# EAGLE design GPS_Tracker_V3 (EAGLE 6.5.0)
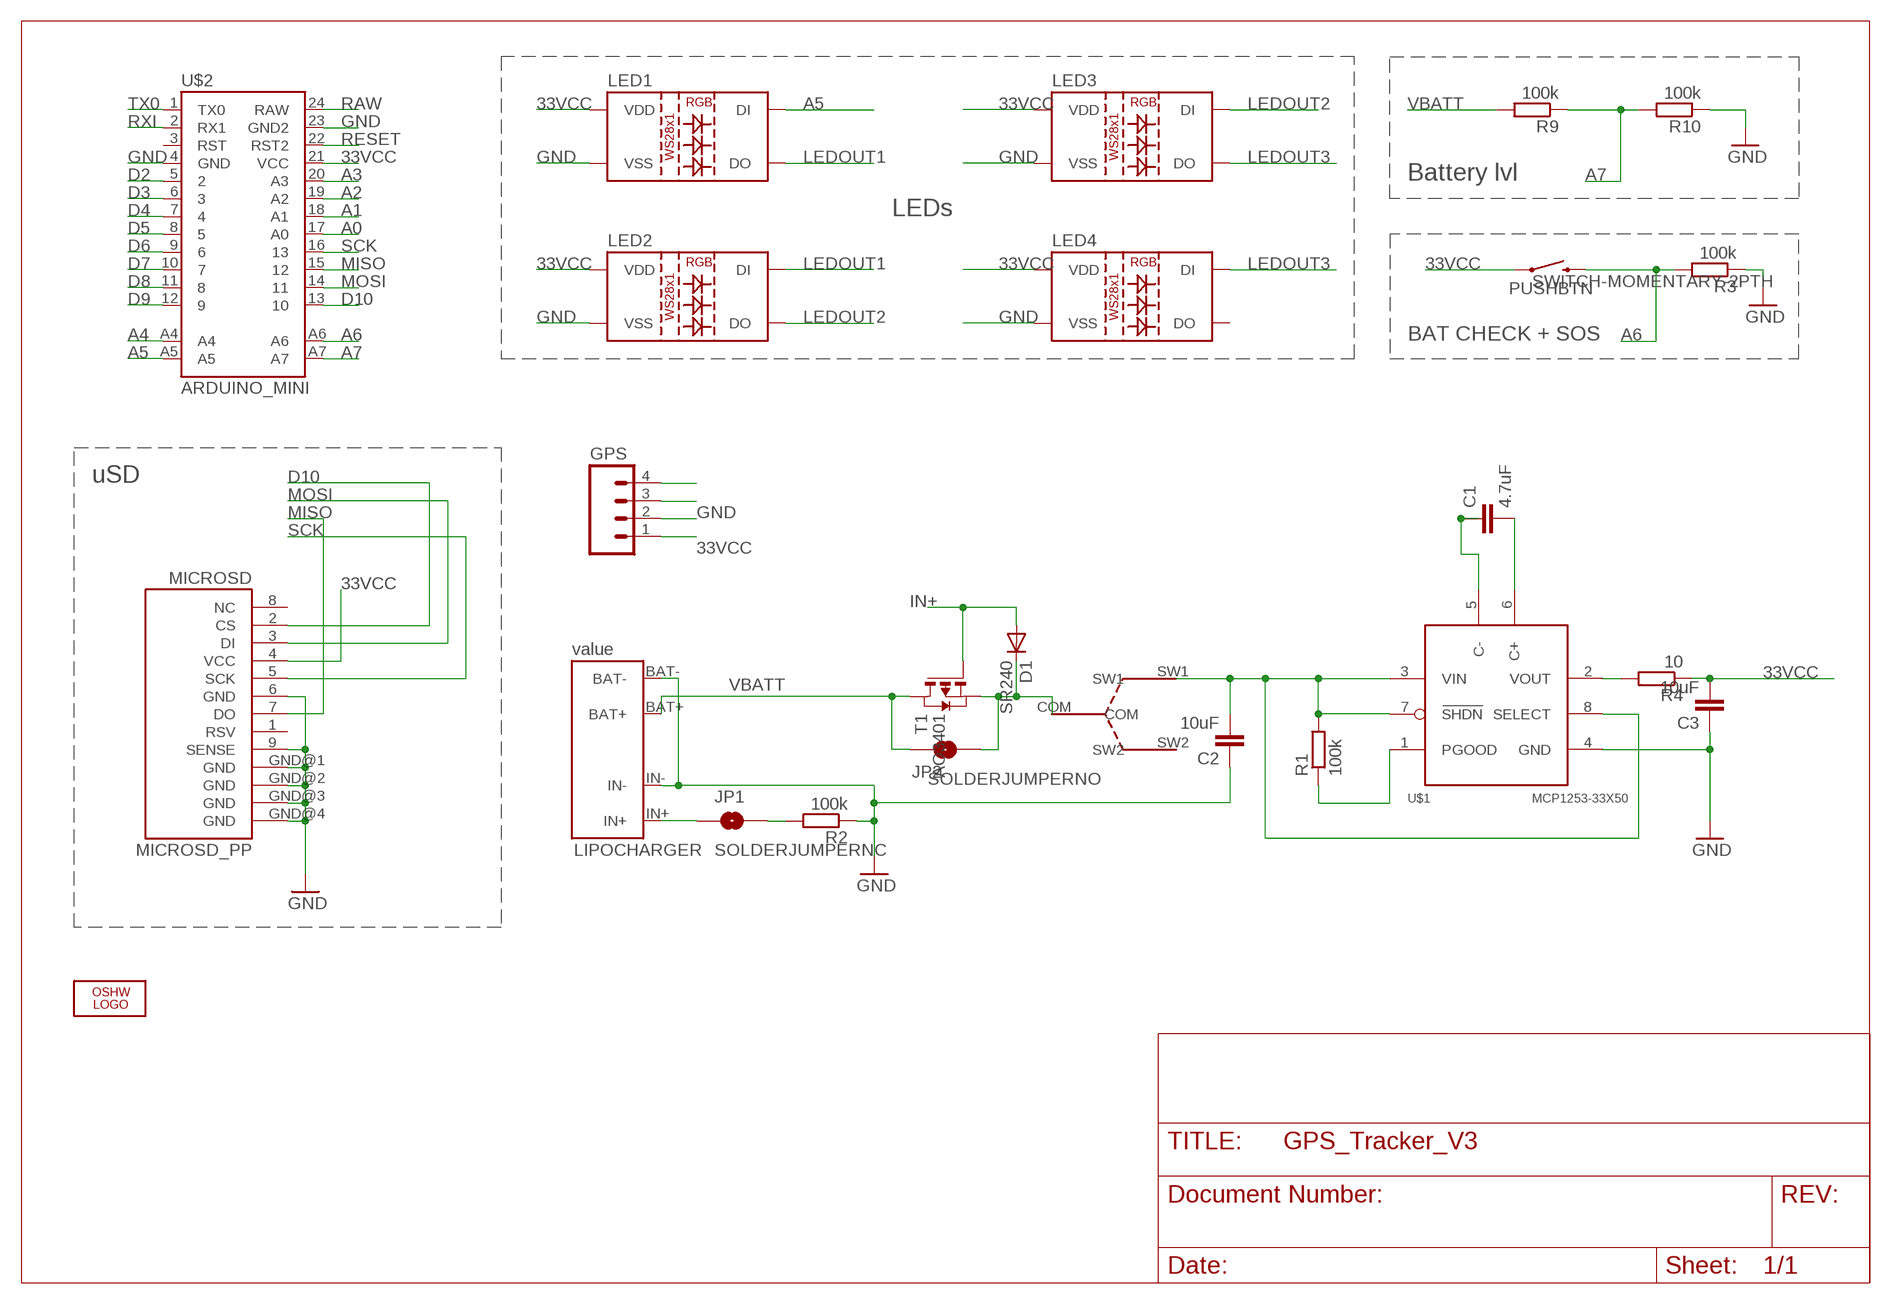
[diagram p0: schematic, sheet 1]

## Parts
C1  4.7uF  C-EUC1206  [C1206]
C2  10uF  C-EUC1206  [C1206]
C3  10uF  C-EUC1206  [C1206]
D1  SR240  DIODE-DO214AC  [DO214AC]
GPS  M04PTH  [1X04]
JP1  SOLDERJUMPERNC  [SJ_2S]
JP2  SOLDERJUMPERNO  [SJ_2S-NO]
LED1  LED-TRICOLOR-5050-ICWS2811  [LED-TRICOLOR-5050-IC]
LED2  LED-TRICOLOR-5050-ICWS2811  [LED-TRICOLOR-5050-IC]
LED3  LED-TRICOLOR-5050-ICWS2811  [LED-TRICOLOR-5050-IC]
LED4  LED-TRICOLOR-5050-ICWS2811  [LED-TRICOLOR-5050-IC]
LIPOCHARGER  LIPO_CHARGER  [LIPO_CHARGER]
LOGO1  OSHW_LOGO_10MILX0200-NT  [OSHW_10X200_NOTEXT]
MICROSD  MICROSD_PP  [MICROSD_PP]
PUSHBTN  SWITCH-MOMENTARY-2PTH  [TACTILE-PTH]
R1  100k  R-EU_R1206  [R1206]
R2  100k  R-EU_R1206  [R1206]
R3  100k  R-EU_R1206  [R1206]
R4  10  R-EU_R1206  [R1206]
R9  100k  R-EU_R1206  [R1206]
R10  100k  R-EU_R1206  [R1206]
SW  SWITCHDAV  [5IL3MM]
T1  AO3401  PMOSSOT23  [SOT-23]
U$1  MCP1253-33X50  [MSOP8]
U$2  ARDUINO_MINI  [ARDUINO_MINI]

## Nets
33VCC: C3.2 GPS.1 LED1.3(VDD) LED1.5(VDD) LED2.3(VDD) LED2.5(VDD) LED3.3(VDD) LED3.5(VDD) LED4.3(VDD) LED4.5(VDD) MICROSD.4(VCC) PUSHBTN.1 R4.1 U$2.21(VCC)
A0: U$2.17(A0)
A1: U$2.18(A1)
A2: U$2.19(A2)
A3: U$2.20(A3)
A4: U$2.A4
A5: LED1.2(DI) U$2.A5
A6: PUSHBTN.3 R3.2 U$2.A6
A7: R9.1 R10.2 U$2.A7
D2: U$2.5
D3: U$2.6
D4: U$2.7
D5: U$2.8
D6: U$2.9
D7: U$2.10
D8: U$2.11
D9: U$2.12
D10: MICROSD.2(CS) U$2.13
GND: C2.1 C3.1 GPS.2 LED1.6(VSS) LED2.6(VSS) LED3.6(VSS) LED4.6(VSS) LIPOCHARGER.BAT- LIPOCHARGER.IN- MICROSD.6(GND) MICROSD.9(SENSE) MICROSD.GND@1(GND) MICROSD.GND@2(GND) MICROSD.GND@3(GND) MICROSD.GND@4(GND) R2.1 R3.1 R10.1 U$1.4(GND) U$2.4(GND) U$2.23(GND2)
IN+: D1.A JP1.2 R2.2 T1.3(G)
LEDOUT1: LED1.1(DO) LED2.2(DI)
LEDOUT2: LED2.1(DO) LED3.2(DI)
LEDOUT3: LED3.1(DO) LED4.2(DI)
MISO: MICROSD.7(DO) U$2.15
MOSI: MICROSD.3(DI) U$2.14
N$1: C2.2 R1.2 SW.SW1 U$1.3(VIN) U$1.7(SHDN) U$1.8(SELECT)
N$2: C1.1 U$1.5(C-)
N$3: C1.2 U$1.6(C+)
N$4: D1.C JP2.2 SW.COM T1.2(S)
N$5: R1.1 U$1.1(PGOOD)
N$6: R4.2 U$1.2(VOUT)
N$7: JP1.1 LIPOCHARGER.IN+
N$8: GPS.3
N$9: GPS.4
RAW: U$2.24(RAW)
RESET: U$2.22(RST2)
RXI: U$2.2(RX1)
SCK: MICROSD.5(SCK) U$2.16
TX0: U$2.1(TX0)
VBATT: JP2.1 LIPOCHARGER.BAT+ R9.2 T1.1(D)
Unconnected: LED4.1(DO) MICROSD.1(RSV) MICROSD.8(NC) SW.SW2 U$2.3(RST)

## Notes on the sheet
- Battery lvl
- LEDs
- BAT CHECK + SOS
- uSD

## Library data of the parts
C1-C3 = rcl:C-EU: CAPACITOR, European symbol
D1 = diode:DIODE-: DIODE
GPS = SparkFun-Connectors:M04: Header 4 Standard 4-pin 0.1" header. Use with straight break away headers (SKU : PRT-00116), right angle break away headers (PRT-00553), swiss pins (PRT-00743), machine pins (PRT-00117), and female headers (PRT-00115). Molex polarized connector foot print use with SKU : PRT-08231 with associated crimp pins and housings. 1MM SMD Version SKU: PRT-10208
JP1 JP2 = SparkFun-Passives:SOLDERJUMPER: Solder Jumper Standard SMD solder jumper. Used to automate production. Two varients : Normally Open and Normally Closed are the same, but have different paste layers. NC will have a large amount of paste and should jumper during reflow.
LED1-LED4 = SparkFun-LED:LED-TRICOLOR-5050-IC: 5x5mm SMD LED with built-in controller IC.
LIPOCHARGER = davLib:LIPO_CHARGER
LOGO1 = ohw-logo:OSHW_LOGO_10MIL
MICROSD = DE1594-v2:MICROSD_PP
PUSHBTN = SparkFun-Electromechanical:SWITCH-MOMENTARY-2: Various NO switches- pushbuttons, reed, etc
R1-R4 R9 R10 = rcl:R-EU_: RESISTOR, European symbol
SW = davLib:SWITCHDAV
T1 = zetex:PMOSSOT23: MOS FET; OC_FARNELL: unknown; OC_NEWARK: unknown
U$1 = microchip-mcp125x-xxx:MCP1253-33X50
U$2 = davLib:ARDUINO_MINI: Arduino Pro Mini footprint

## Board
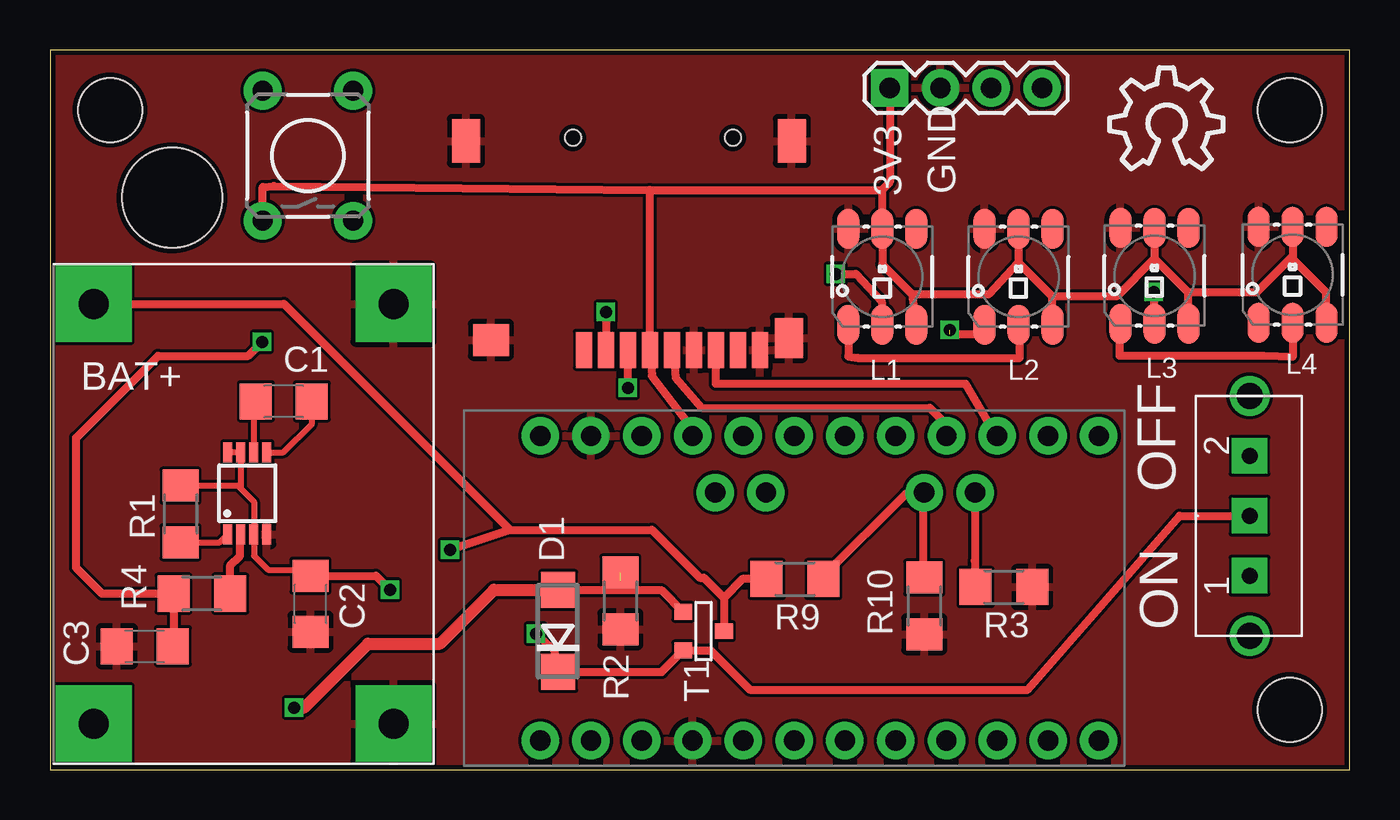
[diagram p1: board, top side]
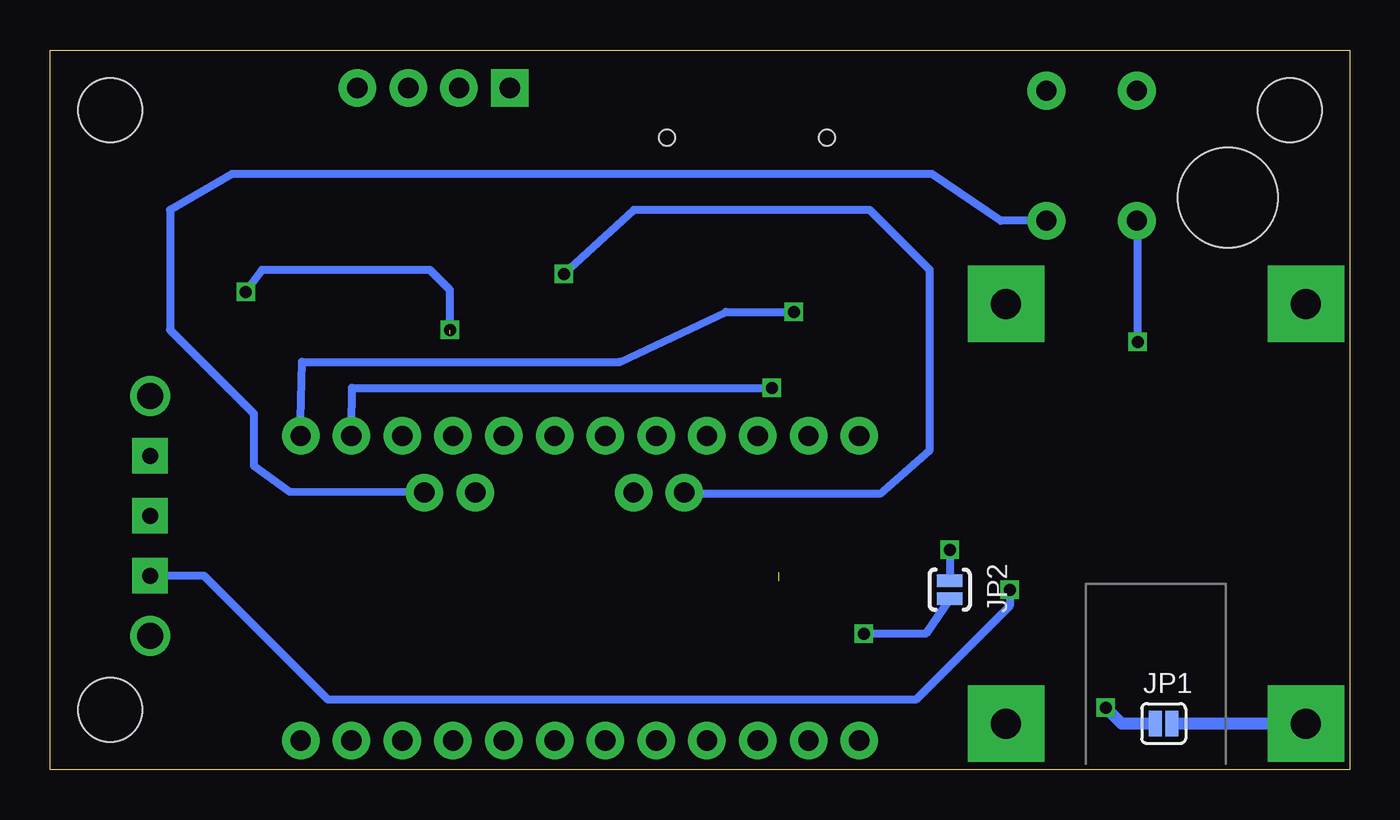
[diagram p2: board, bottom side, seen from below]

Size 65 x 36 mm. Coordinates in mm from the lower left corner, seen from the top.
Outline: 0,0 65,0 65,36 0,36 0,0
Copper layers (1*16): Top 0.035mm / dielectric 0.2mm / Bottom 0.035mm
Design rules "SeeedStudio_DRU_no_angle_20130527": minimum track width 6mil, minimum drill 12mil, track to track 6mil, track to pad 6mil, pad to pad 6mil, via to via 6mil, smd to smd 0mil, copper to edge 10mil, drill to drill 10mil, minimum pad ring 6mil, minimum via ring 6mil, stop-mask expansion 2mil, vias tented up to drill 25mil, thermal gap 10mil
Holes 3.2 mm at 3,33 62,3 62,33
Holes 5 mm at 6.1,28.6

### Footprints (pad centres in the part's own frame; a part is rotated, then mirrored left to right if it is on the bottom)
C1206 = smd 1.6 x 1.8: 1 -1.4,0; 2 1.4,0
DO214AC = smd 1.8 x 1.7: A 2.05,0; C -2.05,0
1X04 = drill 1.016 pad 1.88 square: 1 0,0 | drill 1.016 pad 1.88: 2 2.54,0; 3 5.08,0; 4 7.62,0
SJ_2S = smd 0.635 x 1.27: 1 -0.412,0; 2 0.412,0
SJ_2S-NO = smd 0.635 x 1.27: 1 -0.45,0; 2 0.45,0
LED-TRICOLOR-5050-IC = smd 2 x 1.1: 1 -2.4,1.7; 2 -2.4,0; 3 -2.4,-1.7; 4 2.4,-1.7; 5 2.4,0; 6 2.4,1.7
LIPO_CHARGER = drill 1.5 pad 3.81 square: BAT+ 7,-10; BAT- -8,-10; IN+ 7,11; IN- -8,11
MICROSD_PP = smd 1.8 x 0.8: 1 0,3.85; 2 0,2.75; 3 0,1.65; 4 0,0.55; 5 0,-0.55; 6 0,-1.65; 7 0,-2.75; 8 0,-3.85; 9 0,-4.95 | smd 1.6 x 1.8: GND@1 0.5,8.5 | smd 2.2 x 1.4: GND@2 10.45,9.75; GND@4 10.45,-6.55 | smd 2 x 1.4: GND@3 0.6,-6.4 | hole 0.8: 10.6,4.4; 10.6,-3.6
TACTILE-PTH = drill 1.016 pad 1.88: 1 -3.251,2.261; 2 3.251,2.261; 3 -3.251,-2.261; 4 3.251,-2.261
R1206 = smd 1.6 x 1.803: 1 -1.422,0; 2 1.422,0
5IL3MM = drill 0.8 pad 1.778 square: COM 0,0; SW1 -3,0; SW2 3,0 | drill 1.3 pad 2: SUPPORT1 -6,0; SUPPORT2 6,0
SOT-23 = smd 0.787 x 0.889: 1 0.025,-1.016; 2 -0.94,1.016; 3 0.991,1.016
MSOP8 = smd 0.45 x 1: 1 -0.975,-2.05; 2 -0.325,-2.05; 3 0.325,-2.05; 4 0.975,-2.05; 5 0.975,2.05; 6 0.325,2.05; 7 -0.325,2.05; 8 -0.975,2.05
ARDUINO_MINI = drill 1.016 pad 1.88: 1 -7.62,12.7; 2 -7.62,10.16; 3 -7.62,7.62; 4 -7.62,5.08; 5 -7.62,2.54; 6 -7.62,0; 7 -7.62,-2.54; 8 -7.62,-5.08; 9 -7.62,-7.62; 10 -7.62,-10.16; 11 -7.62,-12.7; 12 -7.62,-15.24; 13 7.62,-15.24; 14 7.62,-12.7; 15 7.62,-10.16; 16 7.62,-7.62; 17 7.62,-5.08; 18 7.62,-2.54; 19 7.62,0; 20 7.62,2.54; 21 7.62,5.08; 22 7.62,7.62; 23 7.62,10.16; 24 7.62,12.7; A4 4.79,1.41; A5 4.79,3.95; A6 4.79,-9.05; A7 4.79,-6.51

### Placement (x,y rotation side)
C1  11.69,18.42 180 top
C2  13.03,8.29 90 top
C3  4.74,6.17 0 top
D1  25.42,6.93 90 top
GPS  42,34.1 0 top
JP1  9.3,2.3 180 bottom
JP2  20,9 270 bottom
LED1  41.63,24.66 90 top
LED2  48.44,24.66 90 top
LED3  55.24,24.71 90 top
LED4  62.15,24.76 90 top
LIPOCHARGER  9.18,13.3 180 top
LOGO1  53.01,30.04 0 top
MICROSD  30.55,21 90 top
PUSHBTN  12.9,30.71 90 top
R1  6.53,12.79 90 top
R2  28.53,8.44 90 top
R3  47.71,9.13 180 top
R4  7.6,8.8 0 top
R9  37.26,9.53 180 top
R10  43.73,8.19 90 top
SW  60,12.7 90 top
T1  32.69,6.9 90 top
U$1  9.87,13.82 0 top
U$2  37.22,9.07 90 top

### Tracks (layer width: path | path; a pad name or v marks a point on that pad's centre or on a via)
33VCC  (via drill 0.6)
  Top 0.406: U$2.21 32.1,16.53 32.1,17.1 30.1,19.7 MICROSD.4 30,29 | 43.1,23.8 41.63,25.27 LED1.5 41.6,27.09 41.6,29 | 43.1,23.8 43.3,22.29 LED1.3 | LED2.5 48.44,25.36 | 48.44,25.36 50.1,23.7 | 50.1,23.7 50.1,22.3 LED2.3 | LED3.5 55.24,25.56 | 55.24,25.56 56.9,23.9 | 56.9,23.9 56.9,22.35 LED3.3 | LED4.5 62.15,25.7 | 62.15,25.7 62.15,25.55 63.8,23.9 63.8,22.41 LED4.3 | 56.9,23.9 60.35,23.9 62.15,25.7 | 50.1,23.7 53.38,23.7 55.24,25.56 | 43.1,23.8 46.98,23.8 48.44,25.36 | PUSHBTN.1 10.64,29.14 11.2,29.2 30,29 | v10.6,21.4 9.9,20.7 5.4,20.7 1.3,16.6 1.3,10.1 2.6,8.8 R4.1 6.18,6.21 C3.2 | GPS.1 42,29.4 41.6,29 | 30,29 41.6,29
  Bottom 0.406: v10.6,21.4 10.6,27.42 PUSHBTN.1
A5  (via drill 0.6)
  Top 0.406: v39.3,24.8 40.3,24.8 41.6,23.4 41.6,22.29 LED1.2
  Bottom 0.406: v39.3,24.8 35.8,28 24,28 21,25 21,16 23.5,13.8 33.27,13.8 U$2.A5
A6
  Top 0.406: U$2.A6 46.26,10.46 R3.2
  Bottom 0.406: PUSHBTN.3 17.46,27.46 20.9,29.8 55.9,29.8 59,28 59,22 54.8,17.8 54.8,15.2 52.99,13.89 U$2.A6
A7
  Top 0.406: R9.1 38.68,9.68 42.8,13.8 43.67,13.8 U$2.A7 43.67,13 43.67,9.87 R10.2
D10  (via drill 0.6)
  Top 0.406: v27.8,22.9 MICROSD.2
  Bottom 0.406: U$2.13 52.46,17.54 52.4,20.4 36.5,20.4 31.2,22.9 v27.8,22.9
GND
  pour Top: -1,38 67,38 67,-2 -1,-2
IN+  (via drill 0.6)  (1 unrouted)
  Top 0.406: D1.A 29,8.98 | 29,8.98 30.59,8.98 T1.3 | 28.53,9.45 29,8.98
  Top 0.61: v12.2,3.1 12.7,3.1 15.9,6.3 19.5,6.3 22.2,9 25.4,9 D1.A
  Bottom 0.61: JP1.2 11.4,2.3 v12.2,3.1
LEDOUT1
  Top 0.406: LED1.1 39.93,20.67 40.4,20.6 48.5,20.6 48.5,22.2 LED2.2
LEDOUT2  (via drill 0.6)  (1 unrouted)
  Top 0.406: 46.78,21.8 LED2.1 46.28,21.8 45,21.8 | v55.2,23.9 55.2,22.35 LED3.2
  Bottom 0.406: v45,22 45,24 46,25 54.4,25 v55.2,23.9
LEDOUT3
  Top 0.406: LED4.2 62.15,20.65 60.7,20.7 53.5,20.7 53.5,22.27 LED3.1
MISO
  Top 0.406: U$2.15 47.38,16.62 45.8,19.3 33.3,19.3 MICROSD.7 33.3,21.3
MOSI  (via drill 0.6)
  Top 0.406: v28.9,19.1 MICROSD.3
  Bottom 0.406: U$2.14 49.92,17.08 49.9,19.1 v28.9,19.1
N$1  (via drill 0.6)
  Top 0.305: 9.54,14.05 U$1.7 U$1.8 | 9.54,14.05 10.2,13.4 U$1.3 | U$1.3 | U$1.3 10.2,10.7 10.9,10 12.72,10 C2.2 | R1.2 9.39,14.21 9.54,14.05
  Top 0.406: C2.2 16.31,9.69 v17,9
  Bottom 0.406: 17,8.9 v17,9 17,8.2 21.7,3.5 51.1,3.5 57.3,9.7 SW.SW1
N$2
  Top 0.305: U$1.5 11.67,15.87 13.1,17.3 C1.1
N$3
  Top 0.305: U$1.6 10.2,18.33 C1.2
N$4  (via drill 0.6)
  Top 0.406: SW.COM 56.5,12.7 48.9,4 35,4 33.04,5.96 T1.2 30.59,4.88 D1.C 25.34,4.8 25.4,4.8 25.2,6 v24.3,6.8
  Bottom 0.406: JP2.2 21.2,6.8 v24.3,6.8
N$5
  Top 0.305: R1.1 8.49,11.37 U$1.1
N$6
  Top 0.406: R4.2 9.02,10.22 9.5,10.7 9.5,11.72 U$1.2
N$7
  Bottom 0.61: LIPOCHARGER.IN+ JP1.1
SCK
  Top 0.406: 31,21.4 MICROSD.5 31.2,20.9 31.3,19.6 32.6,18.1 44,18.1 44.8,17.3 44.8,16.53 U$2.16
VBATT  (via drill 0.6)
  Top 0.406: LIPOCHARGER.BAT+ 11.7,23.3 23,12 | 23,12 30.1,12 32.5,9.6 32.7,9.6 33.7,8.6 | 33.7,8.6 T1.1 | R9.2 34.63,9.53 33.7,8.6 | 23,12 v20,11
  Bottom 0.406: v20,11 JP2.1

### Text on the board
_tsilk: 3V3 | GND | L3 | L4 | BAT+ | L1 | L2 | OFF | ON
_bsilk: david@davenne.be | GPS Tracker V2.0 | http://david.davenne.be | BAT- | BAT+ | D13 | A3 | RST | VCC | D12 | D11 | D10 | 01.07.2014 | RAW | A2 | A1 | A0 | GND | A5 | A4 | A7 | A6 | RST | D2 | D3 | D4 | D5 | D6 | D7 | D8 | D9 | Max current -> 120mA | TX | RX | GND | LiPo 1 cell with PCM only !